# EAGLE design IoTSSensorBoardV2 (EAGLE 9.6.2)
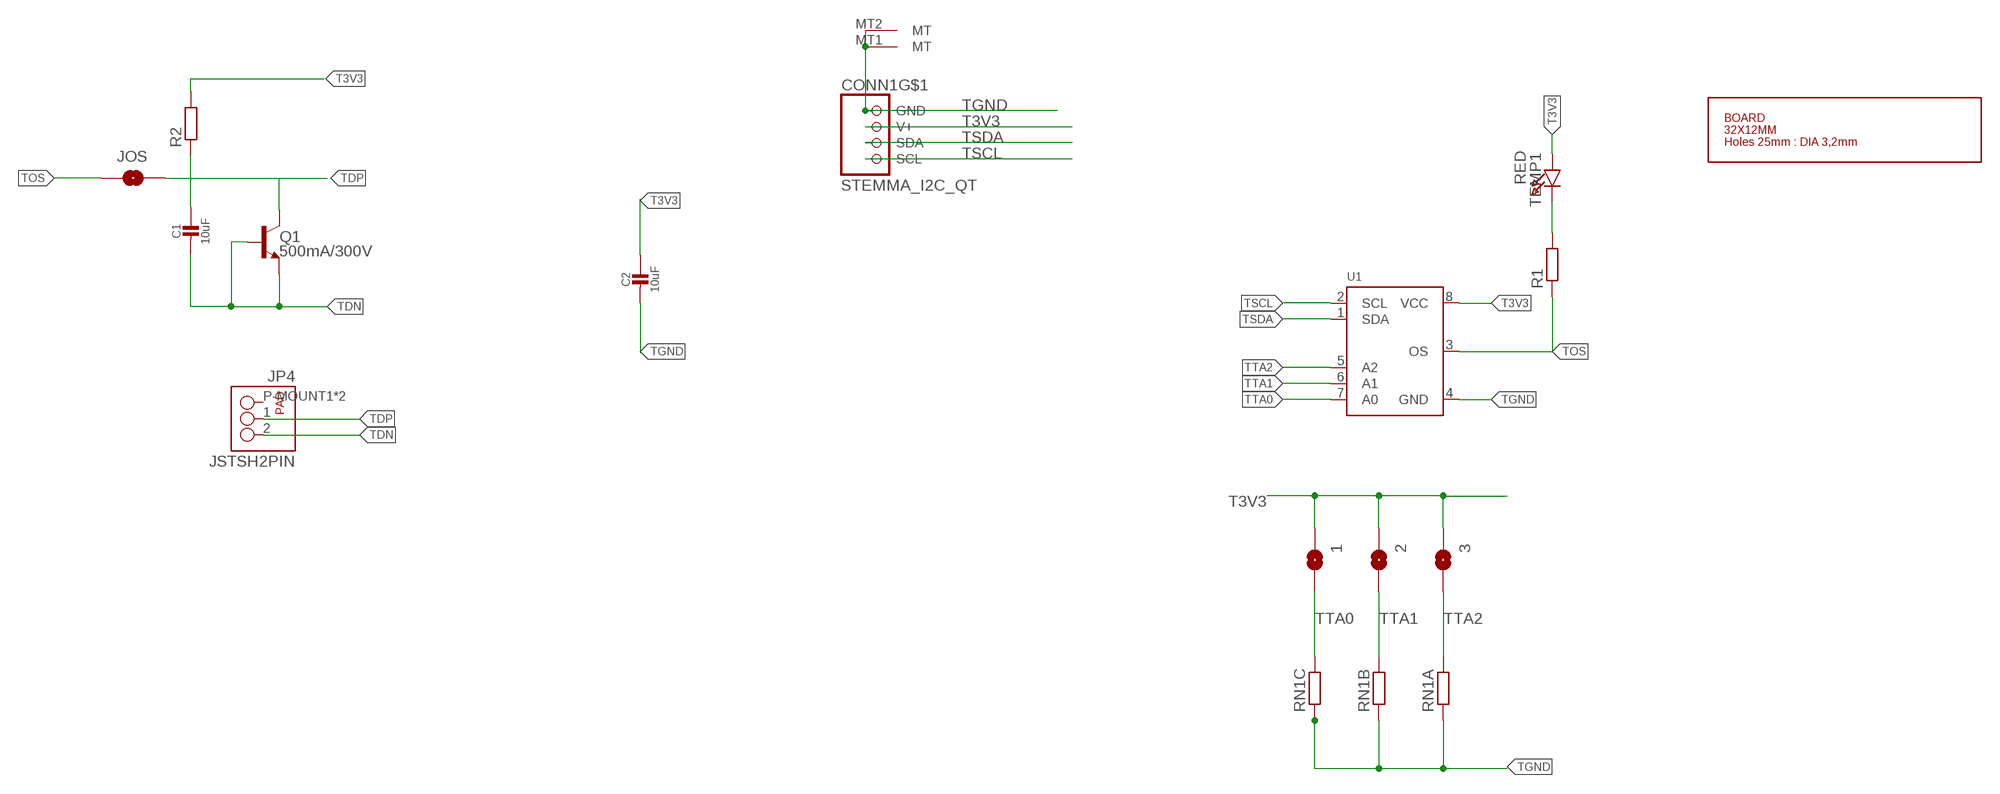
[diagram p0: schematic, sheet 1]

## Parts
1  JUMPER-SMT_2_NO_SILK  [SMT-JUMPER_2_NO_SILK]
2  JUMPER-SMT_2_NO_SILK  [SMT-JUMPER_2_NO_SILK]
3  JUMPER-SMT_2_NO_SILK  [SMT-JUMPER_2_NO_SILK]
C1  10uF  CAP_CERAMIC0805-NOOUTLINE  [0805-NO]
C2  10uF  CAP_CERAMIC0805-NOOUTLINE  [0805-NO]
CONN1  STEMMA_I2C_QT  [JST_SH4]
JOS  JUMPER-SMT_2_NO_SILK  [SMT-JUMPER_2_NO_SILK]
JP4  JSTSH2PIN  [SM02B-SRSS-TB]
Q1  500mA/300V  TRANS_NPN-MMBTA42  [SOT23-3]
R1  RESISTORR805-0805  [R805]
R2  RESISTORR805-0805  [R805]
RN1  RESISTOR_ARRAY_4  [RN8P-4R-CRA06S]
TEMP1  RED  LED0805  [CHIPLED_0805]
U1  TEMP_LM75B  [TSSOP8]
U$12  BOARD32X12  [OVAL3212MM]

## Nets
N$23: R1.2 TEMP1.C
T3V3: 1.1 2.1 3.1 C2.1 CONN1.2(V+) R2.2 TEMP1.A U1.8(VCC)
TDN: C1.2 JP4.2 Q1.1(B) Q1.2(E)
TDP: C1.1 JOS.2 JP4.1 Q1.3(C) R2.1
TGND: C2.2 CONN1.1(GND) CONN1.MT1(MT) CONN1.MT2(MT) RN1.1 RN1.2 RN1.3 U1.4(GND)
TOS: JOS.1 R1.1 U1.3(OS)
TSCL: CONN1.4(SCL) U1.2(SCL)
TSDA: CONN1.3(SDA) U1.1(SDA)
TTA0: 1.2 RN1.6 U1.7(A0)
TTA1: 2.2 RN1.7 U1.6(A1)
TTA2: 3.2 RN1.8 U1.5(A2)
Unconnected: JP4.P-MOUNT1 JP4.P-MOUNT2 RN1.4 RN1.5

## Library data of the parts
1-3 JOS = SparkFun-Jumpers:JUMPER-SMT_2_NO: Normally open jumper This jumper has two pads in close proximity to each other. Apply solder to close the connection. Round pads are easier to solder for beginners, but are a lot larger. SparkFun Product that uses the round pads: SparkFun EL Sequencer <https://www.sparkfun.com/products/12781>
C1 C2 = microbuilder:CAP_CERAMIC: Ceramic Capacitors For new designs, use the packages preceded by an '_' character since they are more reliable: The following footprints should be used on most boards: _0402 - Standard footprint for regular board layouts _0603 - Standard footprint for regular board layouts _0805 - Standard footprint for regular board layouts _1206 - Standard footprint for regular board layouts For extremely tight-pitch boards where space is at a premium, the following 'micro-pitch' footprints can be used (smaller pads, no silkscreen outline, etc.): _0402MP - Micro-pitch footprint for very dense/compact boards _0603MP - Micro-pitch footprint for very dense/compact boards _0805MP - Micro-pitch footprint for very dense/compact boards _1206MP - Micro-pitch footprint for very dense/compact boards
CONN1 = microbuilder:STEMMA_I2C
JP4 = con-jst-shMax:JSTSH2PIN
Q1 = SparkFun-DiscreteSemi:TRANS_NPN: NPN transistor Current controlled devices typically used to amplify current or used as a switch. BC547 - COM-08928 <http://www.sparkfun.com/products/8928> (TO-92 45V 100mA) (1.Collector 2.Base 3.Emitter) 2N3904 - COM-00521 <http://www.sparkfun.com/products/521> (TO-92 40V 200mA) (1.Emitter 2.Base 3.Collector) P2N2222A - COM-12852 <http://www.sparkfun.com/products/12852> (TO-92 40V 600mA) (1.Collector 2.Base 3.Emitter); PROD_ID: TRANS-09116
R1 R2 = dp_devices:RESISTOR
RN1 = dp_devices:RESISTOR_ARRAY_4: 4 Resistor Array 0603
TEMP1 = microbuilder:LED: LED 0603 - 0603 Surface Mount Package 2mA: Green LED - Low Power (3.9mcd, 2ma, 1.7Vf) - Digikey: 475-2709-2-ND Orange LED - Low Power (9.8mcd, 2ma, 1.8Vf) - Digikey: 475-1194-2-ND Red LED - Low Power (5mcd, 2ma, 1.8Vf) - Digikey: 475-1195-2-ND Yellow LED - Low Power (7mcd, 2ma, 1.8Vf) - Digikey: 475-1196-2-ND 5mA: Blue LED - Low Power (17mcd, 5ma, 2.9Vf) - Digikey: LNJ937W8CRACT-ND 0805 - 0805 Surface Mount Package 2mA: Red LED (8.8mcd, 2mA, 1.8Vf, Clear) - Low Power [Digikey: 475-2510-1-ND] Green LED (5mcd, 2mA, 1.8Vf, Clear) - Low Power [Digikey: 475-2730-1-ND] Yellow LED (11.3mcd, 2mA, 1.8Vf, Clear) - Low Power [Digikey: 475-2555-1-ND] 20mA: Red LED (104mcd, 20mA, Diffused) - LS R976 [Digikey: 475-1278-6-ND] Red LED (12mcd, 20mA, 2.0Vf, Clear) - APT2012EC [Digikey: 754-1128-1-ND] Green LED (15mcd, 20mA, 2.2Vf, Clear) - APT2012GC [Digikey: 754-1131-1-ND] Orange LED (160mcd, 20mA, 2.1Vf, Clear) - APT2012SECK [Digikey: 754-1130-1-ND] 1206 - 1206 Surface Mount Package Green LED (26mcd, 20mA, Diffused) - LG N971 [Digikey: 475-1407-6-ND] Red LED (15mcd, 20mA, Diffused) - LH N974 [Digikey: 475-1416-6-ND]
U1 = microbuilder:TEMP_LM75B: LM75B I2C Temperature Sensor The I2C-based LM75B can measure temperature between -55 and 125°C in 0.125°C increments (11-bit resolution). Digikey: 568-4768-1-ND For a 1.8V compatible part, look at the following pin and SW compatible parts: DS75LV - Mouser: 700-DS75LVS, Digikey: (TSSOP8) DS75LVU+-ND (SOIC8) DS75LVS+-ND
U$12 = MyBreadBoards:BOARD32X12

## Net classes
0 default: clearance 0.127 mm
1 power: width 0.127 mm, drill 0.305 mm
2 lowpower: width 0.254 mm, drill 0.483 mm
3 usbvcc: width 0.127 mm, drill 0.305 mm, clearance 0.254 mm to class 0, clearance 0.254 mm to class 1, clearance 0.254 mm to class 2, clearance 0.254 mm
4 ThermoDiode: clearance 0.025 mm

## Board
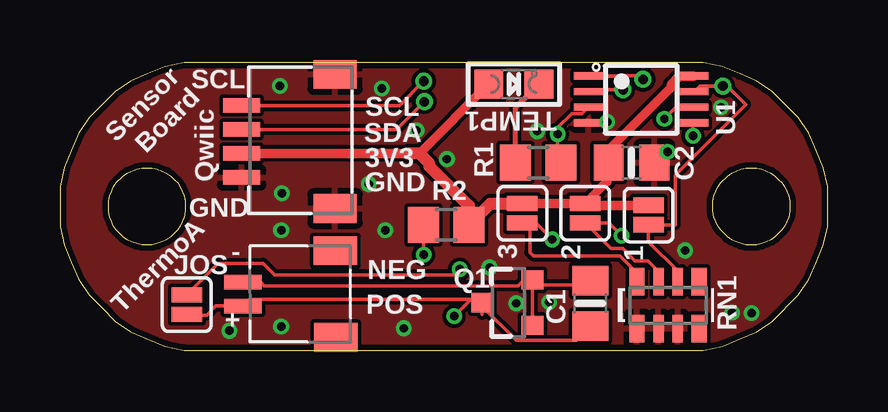
[diagram p1: board, top side]
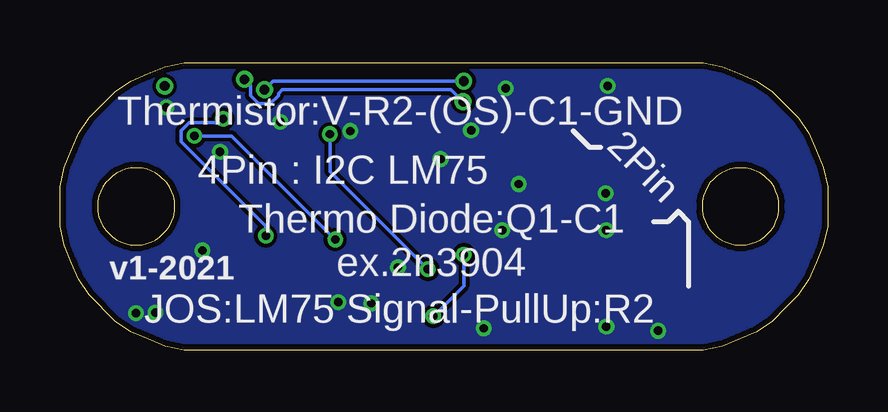
[diagram p2: board, bottom side, seen from below]

Size 32 x 12 mm. Coordinates in mm from the lower left corner, seen from the top.
Copper layers (1*16): Top 0.035mm / dielectric 1.5mm / Bottom 0.035mm
Design rules "dirt_cheap_dirty_boards.v2 *": minimum track width 6mil, minimum drill 12mil, track to track 6mil, track to pad 6mil, pad to pad 6mil, via to via 6mil, smd to smd 0mil, copper to edge 10mil, drill to drill 10mil, minimum pad ring 10mil, minimum via ring 6mil, stop-mask expansion 2mil, vias tented up to drill 25mil, thermal gap 10mil

### Footprints (pad centres in the part's own frame; a part is rotated, then mirrored left to right if it is on the bottom)
SMT-JUMPER_2_NO_SILK = smd 0.635 x 1.27: 1 -0.406,0; 2 0.406,0
0805-NO = smd 1.24 x 1.5: 1 -0.95,0; 2 0.95,0
JST_SH4 = smd 0.6 x 1.55: 1 -1.5,2.514; 2 -0.5,2.514; 3 0.5,2.514; 4 1.5,2.514 | smd 1.2 x 1.8: MT1 -2.8,-1.386; MT2 2.8,-1.386
SM02B-SRSS-TB = smd 0.6 x 1.55: 1 -2.5,0; 2 -1.5,0 | smd 1.2 x 1.8: P-MOUNT1 -3.8,-3.875; P-MOUNT2 -0.193,-3.86
SOT23-3 = smd 0.8 x 0.9: 1 -0.95,-1; 2 0.95,-1; 3 0,1.1
R805 = smd 1.3 x 1.5: 1 -0.95,0; 2 0.95,0
RN8P-4R-CRA06S = smd 0.63 x 1.15: 1 -1.295,-0.975; 4 1.295,-0.975; 5 1.295,0.975; 8 -1.295,0.975 | smd 0.44 x 1.15: 2 -0.4,-0.975; 3 0.4,-0.975; 6 0.4,0.975; 7 -0.4,0.975
CHIPLED_0805 = smd 1.2 x 1.2: A 0,-1.05; C 0,1.05
TSSOP8 = smd 1.2 x 0.305: 1 -2.2,0.975; 2 -2.2,0.325; 3 -2.2,-0.325; 4 -2.2,-0.975; 5 2.2,-0.975; 6 2.2,-0.325; 7 2.2,0.325; 8 2.2,0.975

### Placement (x,y rotation side)
1  24.54,5.64 270 top
2  21.9,5.71 270 top
3  19.28,5.71 270 top
C1  22.11,1.95 90 top
C2  23.83,7.82 0 top
CONN1  10.09,8.71 90 top
JOS  5.29,1.9 270 top
JP4  7.62,4.34 90 top
Q1  18.7,1.99 90 top
R1  19.94,7.82 180 top
R2  16.11,5.23 0 top
RN1  25.35,1.88 0 top
TEMP1  18.92,11.1 270 top
U1  24.23,10.46 0 top
U$12  -0.23,-0.26 0 top

### Tracks (layer width: path | path; a pad name or v marks a point on that pad's centre or on a via)
N$23
  Top 0.2: R1.2 18.99,10.11 TEMP1.C
T3V3
  Top 0.4: TEMP1.A 14.98,8.2 14.58,8.2 | CONN1.2 7.58,8.2 14.53,8.2 | 2.1 21.98,6.2 | 19.21,6.05 3.1 2.1 | 2.1 21.97,6.04 1.1 | 2.1 22.81,7.03 22.81,7.76 C2.1 22.88,8.37 25.48,10.97 25.48,11.09 25.83,11.44 U1.8
  Top 0.5: 3.1 17.94,6.12 R2.2 17.06,6.02 15.4,7.67 15.4,7.78 14.98,8.2 14.53,8.2
TDN
  Top 0.152: Q1.1 19.7,2.72 | 19.7,2.72 Q1.2 19.35,2.94 19.1,2.69 8.51,2.69 8.36,2.84 JP4.2 | C1.2 21.92,2.72 19.7,2.72
TDP  (via drill 0.35)
  Top 0.152: 17.14,2.12 7.9,2.12 JP4.1 6.5,1.84 6.12,1.46 5.32,1.46 JOS.2 | Q1.3 17.46,2.12 17.14,2.12 | Q1.3 17.6,1.49 | 21.9,0.63 21.9,0.77 | C1.1 22.11,0.98 21.9,0.77 | Q1.3 17.6,1.83 19.02,0.41 21.54,0.41 21.9,0.77 | R2.1 15.16,4 v15.17,3.99 | v16.44,1.42 17.14,2.12
  Bottom 0.152: v15.17,3.99 15.17,2.69 v16.44,1.42
TGND  (via drill 0.35)
  Top 0.5: C2.2 25.23,8.28 v25.33,8.28
  other vias: 7.06,0.81 16.13,7.97 9.17,11.02 19.89,9.14 19.03,1.95 13.57,5 28.02,1.57 22.81,9.52 27.56,10.13 17.91,3.45 28.83,1.55 14.33,0.91 9.22,0.99 9.22,5 9.25,6.55 13.41,10.92 12.88,6.93 14.86,9.17 20.4,2.01 26.06,4.16
  pour Bottom: -2.51,16.05 -2.51,-0.71 -0.05,-3.18 31.19,-3.18 35.77,1.4 35.77,12.6 30.79,17.58 -0.94,17.58 -2.39,16.13
  pour Top: -2.67,17.12 -2.67,0.35 -0.2,-2.11 31.04,-2.11 35.61,2.46 35.61,13.66 30.63,18.64 -1.09,18.64 -2.54,17.19
TOS  (via drill 0.35)
  Top 0.152: U1.3 21.76,9.87 21.34,9.87 20.75,9.28 v20.75,9.02 20.75,7.96 R1.1 | v16.66,3.38 16.44,3.15 8.94,3.15 8.47,3.62 6.6,3.62 JOS.1
  Bottom 0.152: v16.66,3.38 20.75,7.46 v20.75,9.02
TSCL  (via drill 0.4)
  Top 0.152: CONN1.4 14.15,10.21 v15.17,11.23 | v23.47,10.87 22.12,10.87 U1.2
  Bottom 0.152: v15.17,11.23 23.12,11.23 v23.47,10.87
TSDA  (via drill 0.4)
  Top 0.152: U1.1 23.22,11.44 23.23,11.45 24.16,11.45 v24.31,11.3 | v15.19,10.37 14.03,9.21 CONN1.3
  Bottom 0.152: v24.31,11.3 24.05,11.04 24.05,10.63 23.71,10.29 23.23,10.29 22.89,10.63 22.89,10.71 22.74,10.87 15.69,10.87 v15.19,10.37
TTA0  (via drill 0.4)
  Top 0.152: U1.7 26.67,11.02 v27.64,11.02 27.82,11.02 28.59,10.25 25.66,7.31 25.66,5.23 1.2 24.54,4.52 25.75,3.31 RN1.6
TTA1  (via drill 0.35)
  Top 0.152: RN1.7 24.95,3.29 24.51,3.73 23.98,3.73 23.47,4.24 22.96,4.24 2.2 22.89,5.31 v23.42,4.77 | v25.2,9.65 25.69,10.14 U1.6
  Bottom 0.152: v23.42,4.77 23.42,5.18 26.95,8.71 26.95,9.17 26.62,9.5 25.35,9.5 v25.2,9.65
TTA2  (via drill 0.35)
  Top 0.152: RN1.8 24.06,3.22 23.34,3.94 19.74,3.94 19.59,4.09 19.59,5 3.2 19.84,5.31 v20.53,4.62 | v26.39,8.94 26.39,9.45 U1.5
  Bottom 0.152: v20.53,4.62 24.84,8.94 v26.39,8.94

### Text on the board
tPlace: Sensor / Board | SCL | SCL | SDA | 3V3 | Qwiic | GND | GND | ThermoA | - | NEG | POS | +
bPlace: Thermistor:V-R2-(OS)-C1-GND | 2Pin | 4Pin : I2C LM75 | Thermo Diode:Q1-C1 / ex.2n3904 | v1-2021 | JOS:LM75 Signal-PullUp:R2